# EAGLE design brain-test (EAGLE 6.4)
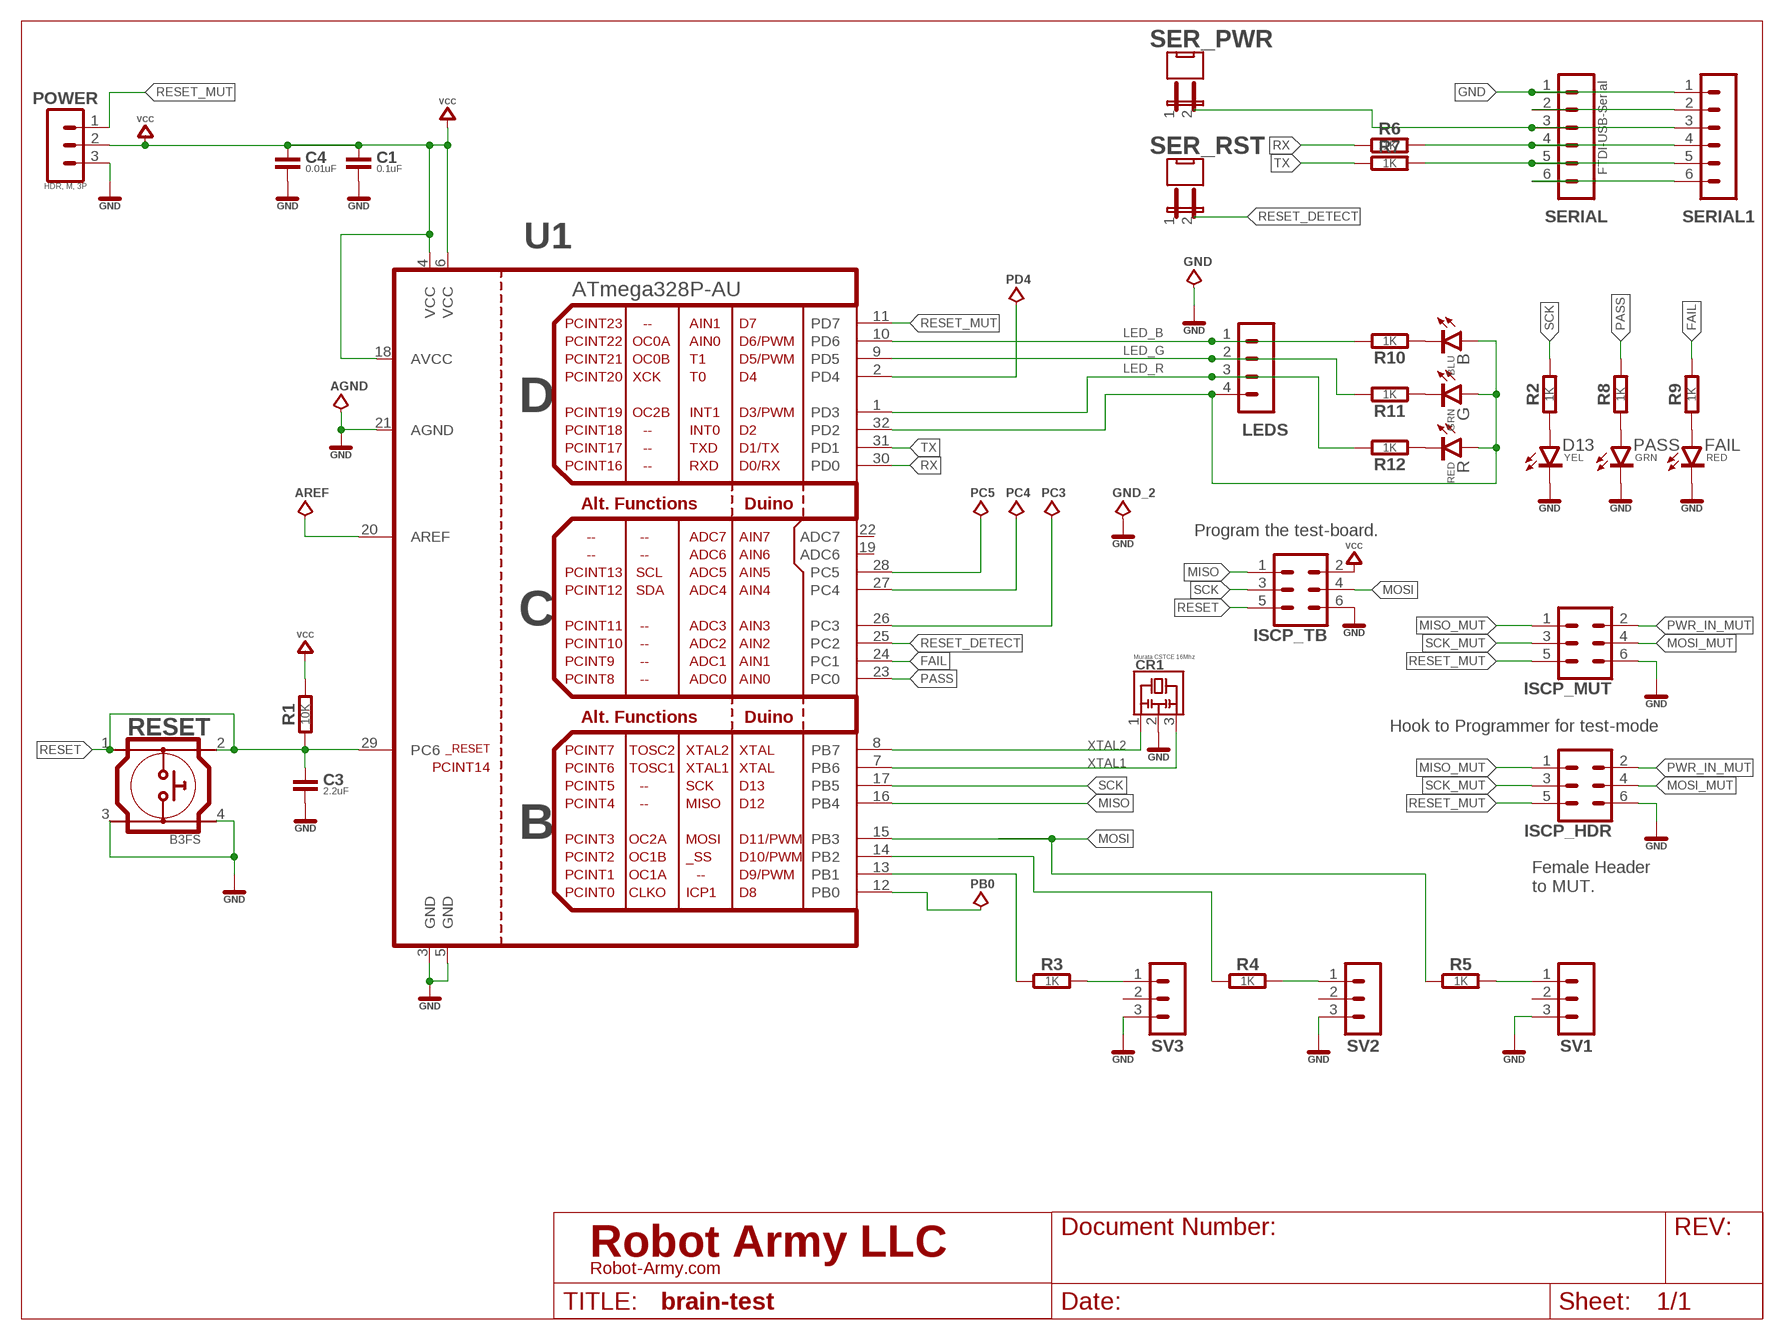
[diagram p0: schematic, sheet 1]
FRAME1 (LETTER_L-LIGHTPLAY): DOCUMENT_NUMBER: LP-BRAIN-01; REV: E

## Parts
AGND  TEST_POINT_SM_2X2  [TP-SMT-020X020]
AREF  TEST_POINT_SM_2X2  [TP-SMT-020X020]
B  BLU  SMT0603  [SMD_0603]
C1  0.1uF  CAPACITOR0603  [0603]
C3  2.2uF  CAPACITOR0603  [0603]
C4  0.01uF  CAPACITOR0603  [0603]
CR1  Murata CSTCE 16Mhz  RESONATORMURATA-CSTCE  [MURATA_CSTCE]
D13  YEL  SMT0603  [SMD_0603]
FAIL  RED  SMT0603  [SMD_0603]
G  GRN  SMT0603  [SMD_0603]
GND  TEST_POINT_SM_2X2  [TP-SMT-020X020]
GND_2  TEST_POINT_SM_2X2  [TP-SMT-020X020]
ISCP_HDR  MA03-2  [MA03-2]
ISCP_MUT  MA03-2  [MA03-2]
ISCP_TB  MA03-2  [MA03-2]
LEDS  MA04-1  [MA04-1]
PASS  GRN  SMT0603  [SMD_0603]
PB0  TEST_POINT_SM_2X2  [TP-SMT-020X020]
PC3  TEST_POINT_SM_2X2  [TP-SMT-020X020]
PC4  TEST_POINT_SM_2X2  [TP-SMT-020X020]
PC5  TEST_POINT_SM_2X2  [TP-SMT-020X020]
PD4  TEST_POINT_SM_2X2  [TP-SMT-020X020]
POWER  HDR, M, 3P  MA03-1  [MA03-1]
R  RED  SMT0603  [SMD_0603]
R1  10K  RESISTOR0603  [0603]
R2  1K  RESISTOR0603  [0603]
R3  1K  RESISTOR0603  [0603]
R4  1K  RESISTOR0603  [0603]
R5  1K  RESISTOR0603  [0603]
R6  1K  RESISTOR0603  [0603]
R7  1K  RESISTOR0603  [0603]
R8  1K  RESISTOR0603  [0603]
R9  1K  RESISTOR0603  [0603]
R10  1K  RESISTOR0603  [0603]
R11  1K  RESISTOR0603  [0603]
R12  1K  RESISTOR0603  [0603]
RESET  B3FS  PUSHBTN-SP-MOM-4PINB3FS  [B3FS]
SER_PWR  JMP01VT  [MA02-1-FAT]
SER_RST  JMP01VT  [MA02-1-FAT]
SERIAL  MA06-1  [MA06-1]
SERIAL1  MA06-1  [MA06-1]
SV1  MA03-1  [MA03-1]
SV2  MA03-1  [MA03-1]
SV3  MA03-1  [MA03-1]
U1  ATmega328P-AU  ATMEGA328  [TQFP-32-08]

## Nets
AREF: AREF.1 U1.20(AREF)
CTS: SERIAL1.2 SERIAL.2
FAIL: R9.2 U1.24(PC1)
GND [gnd]: AGND.1 C1.2 C3.2 C4.2 CR1.2 D13.K(C) FAIL.K(C) GND.1 GND_2.1 ISCP_HDR.6 ISCP_MUT.6 ISCP_TB.6 PASS.K(C) POWER.3 RESET.3 RESET.4 SERIAL1.1 SERIAL.1 SV1.3 SV2.3 SV3.3 U1.3(GND) U1.5(GND) U1.21(AGND)
LED_B: LEDS.1 R10.2 U1.10(PD6)
LED_G: LEDS.2 R11.2 U1.9(PD5)
LED_R: LEDS.3 R12.2 U1.1(PD3)
MISO: ISCP_TB.1 U1.16(PB4)
MISO_MUT: ISCP_HDR.1 ISCP_MUT.1
MOSI: ISCP_TB.4 R5.1 U1.15(PB3)
MOSI_MUT: ISCP_HDR.4 ISCP_MUT.4
N$1: D13.A R2.1
N$2: PASS.A R8.1
N$3: PD4.1 U1.2(PD4)
N$4: PC5.1 U1.28(PC5)
N$5: R3.2 SV3.1
N$6: FAIL.A R9.1
N$7: PC4.1 U1.27(PC4)
N$8: PC3.1 U1.26(PC3)
N$9: R4.2 SV2.1
N$10: R5.2 SV1.1
N$14: B.K(C) R10.1
N$15: G.K(C) R11.1
N$16: R12.1 R.K(C)
N$19: R4.1 U1.14(PB2)
N$20: R3.1 U1.13(PB1)
PASS: R8.2 U1.23(PC0)
PWR_IN: B.A G.A LEDS.4 R.A U1.32(PD2)
PWR_IN_MUT: ISCP_HDR.2 ISCP_MUT.2
RESET: C3.1 ISCP_TB.5 R1.1 RESET.1 RESET.2 U1.29(PC6)
RESET_DETECT: SER_RST.2 U1.25(PC2)
RESET_MUT: ISCP_HDR.5 ISCP_MUT.5 POWER.1 U1.11(PD7)
RTS: SERIAL1.6 SERIAL.6
RX: R6.1 U1.30(PD0)
RXD: R7.2 SERIAL1.5 SERIAL.5
SCK: ISCP_TB.3 R2.2 U1.17(PB5)
SCK_MUT: ISCP_HDR.3 ISCP_MUT.3
SERVO_EN: PB0.1 U1.12(PB0)
TX: R7.1 U1.31(PD1)
TXD: R6.2 SERIAL1.4 SERIAL.4
VCC: C1.1 C4.1 ISCP_TB.2 POWER.2 R1.2 U1.4(VCC) U1.6(VCC) U1.18(AVCC)
VCC5: SER_PWR.2 SERIAL1.3 SERIAL.3
XTAL1: CR1.3 U1.7(PB6)
XTAL2: CR1.1 U1.8(PB7)
Unconnected: SER_PWR.1 SER_RST.1 SV1.2 SV2.2 SV3.2 U1.19(ADC6) U1.22(ADC7)

## Notes on the sheet
- FTDI-USB-Serial
- Program the test-board.
- Hook to Programmer for test-mode
- Female Header
  to MUT.

## Library data of the parts
AGND AREF GND GND_2 PB0 PC3-PC5 PD4 = test-points:TEST_POINT: Test point
B D13 FAIL G PASS R = led:SMT: LED SMT 0603 0805 1206
C1 C3 C4 = rlc:CAPACITOR: Capacitor
CR1 = ceramic-resonators:RESONATOR
ISCP_HDR ISCP_MUT ISCP_TB = con-headers:MA03-2: PIN HEADER
LEDS = con-headers:MA04-1: PIN HEADER
POWER SV1-SV3 = con-headers:MA03-1: PIN HEADER
R1-R12 = rlc:RESISTOR: Resistor
RESET = switch-smd:PUSHBTN-SP-MOM-4PIN: Omron B3S Series Push Button Switch
SER_PWR SER_RST = con-headers:JMP01: Jumper, 1 position (2 pins)
SERIAL SERIAL1 = con-headers:MA06-1: PIN HEADER
U1 = atmel-atmega:ATMEGA328

## Net classes
0 default: width 0.152 mm, clearance 0.152 mm
1 power: width 0.406 mm, drill 0.33 mm, clearance 0.152 mm
2 gnd: width 0.203 mm, drill 0.33 mm, clearance 0.152 mm
3 usbvcc: width 0.203 mm, drill 0.33 mm, clearance 0.152 mm
4 aref: width 0.203 mm, drill 0.33 mm, clearance 0.152 mm

## Board
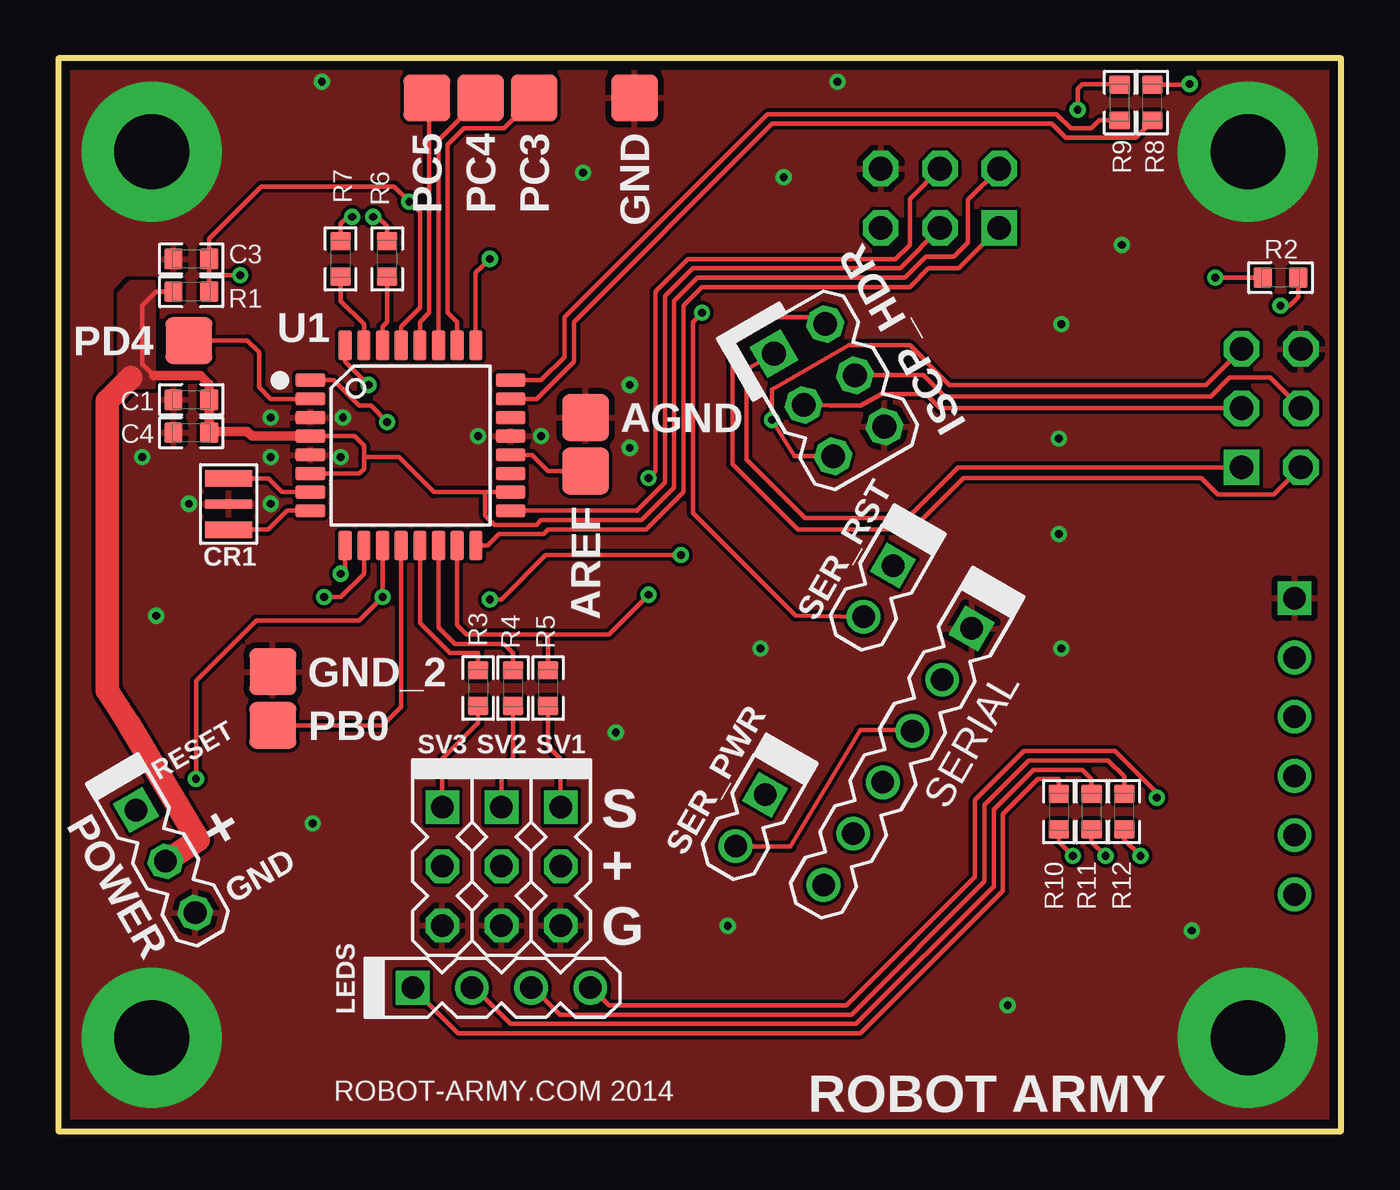
[diagram p1: board, top side]
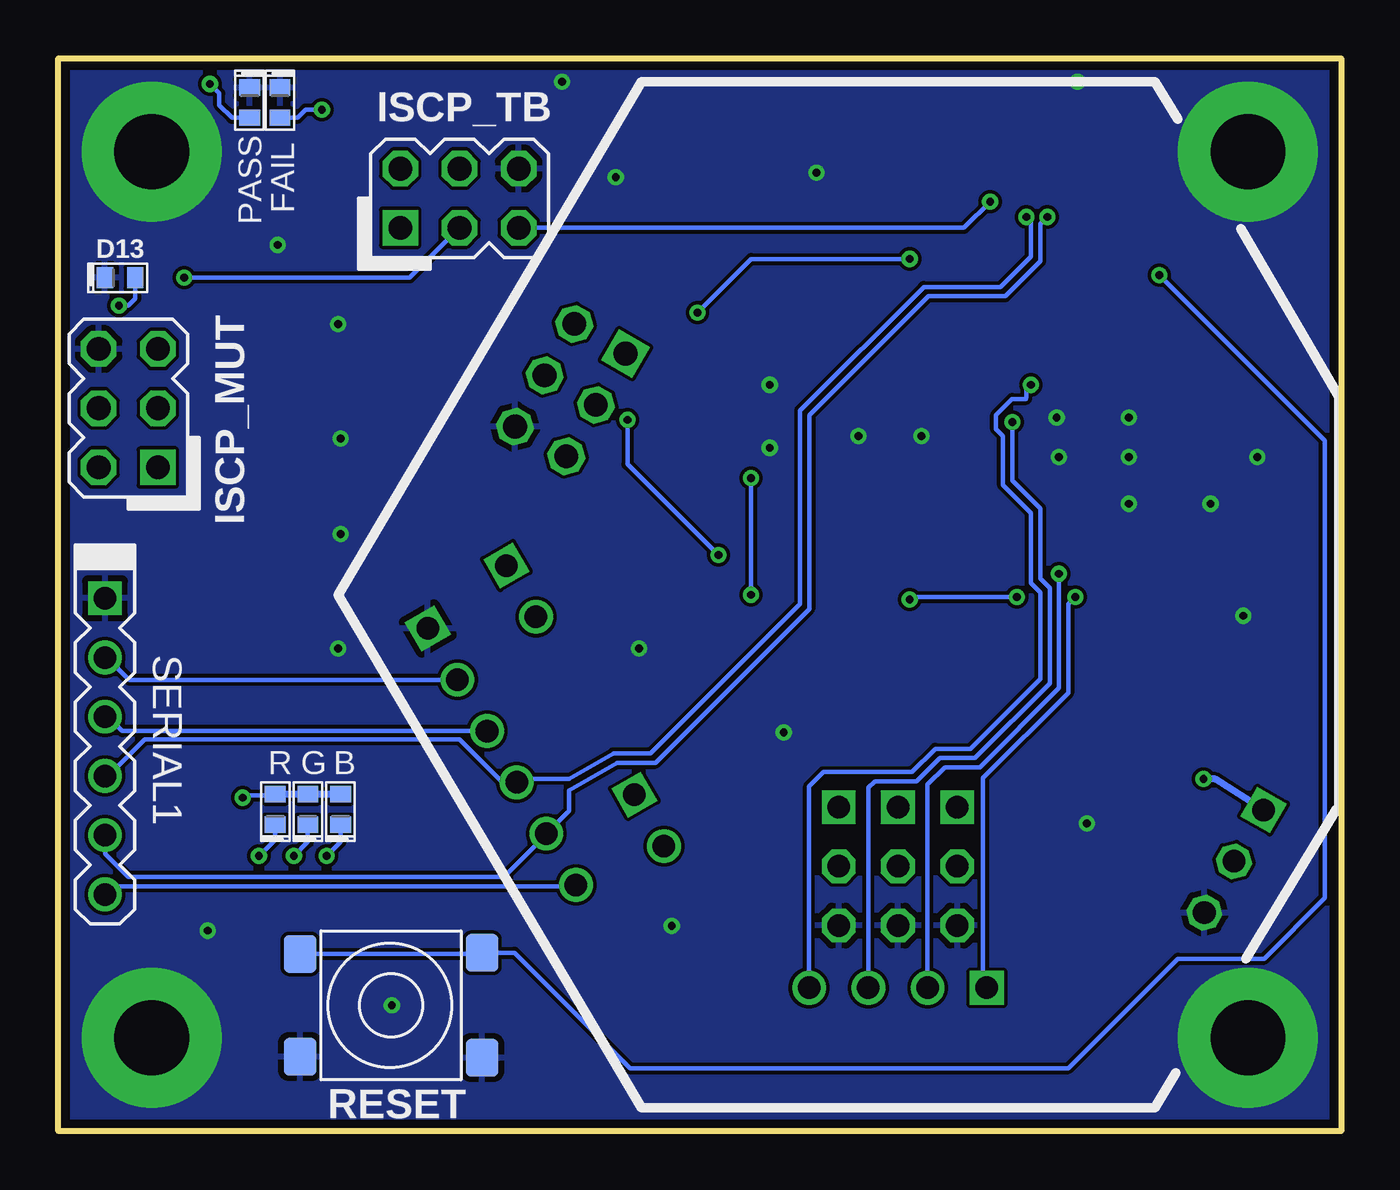
[diagram p2: board, bottom side, seen from below]

Size 55 x 46 mm. Coordinates in mm from the lower left corner, seen from the top.
Outline: 0,0 55,0 55,46 0,46 0,0
Copper layers (1*16): Top 0.0356mm / dielectric 1.5011mm / Bottom 0.0356mm
Design rules "OSH-CircuitMonkey": minimum track width 6mil, minimum drill 13mil, track to track 6mil, track to pad 6mil, pad to pad 6mil, via to via 6mil, smd to smd 6mil, copper to edge 15mil, drill to drill 6mil, minimum pad ring 7mil, minimum via ring 7mil, stop-mask expansion 3mil, vias tented up to drill 13mil, thermal gap 10mil

### Footprints (pad centres in the part's own frame; a part is rotated, then mirrored left to right if it is on the bottom)
TP-SMT-020X020 = smd 2 x 2: 1 0,0
SMD_0603 = smd 0.7 x 0.9: A 0.65,0; K -0.65,0
0603 = smd 0.8 x 0.9: 1 -0.763,0; 2 0.763,0
MURATA_CSTCE = smd 0.7 x 2: 1 -1.1,0; 3 1.1,0 | smd 0.4 x 2: 2 0,0
MA03-2 = drill 1.016 square: 1 -2.54,-1.27 | drill 1.016 octagon: 2 -2.54,1.27; 3 0,-1.27; 4 0,1.27; 5 2.54,-1.27; 6 2.54,1.27
MA04-1 = drill 0.965 square: 1 -3.81,0 | drill 0.965: 2 -1.27,0; 3 1.27,0; 4 3.81,0
MA03-1 = drill 0.965 square: 1 -2.54,0 | drill 0.965 octagon: 2 0,0; 3 2.54,0
B3FS = smd 1.4 x 1.6: 1 3.9,-2.2; 2 -3.9,-2.25; 3 3.9,2.2; 4 -3.9,2.25
MA02-1-FAT = drill 0.965 square: 1 -1.27,0 | drill 0.965: 2 1.27,0
MA06-1 = drill 0.965 square: 1 -6.35,0 | drill 0.965: 2 -3.81,0; 3 -1.27,0; 4 1.27,0; 5 3.81,0; 6 6.35,0
TQFP-32-08 = smd 1.27 x 0.559: 1 -4.293,2.8; 2 -4.293,2; 3 -4.293,1.2; 4 -4.293,0.4; 5 -4.293,-0.4; 6 -4.293,-1.2; 7 -4.293,-2; 8 -4.293,-2.8; 17 4.293,-2.8; 18 4.293,-2; 19 4.293,-1.2; 20 4.293,-0.4; 21 4.293,0.4; 22 4.293,1.2; 23 4.293,2; 24 4.293,2.8 | smd 0.559 x 1.27: 9 -2.8,-4.293; 10 -2,-4.293; 11 -1.2,-4.293; 12 -0.4,-4.293; 13 0.4,-4.293; 14 1.2,-4.293; 15 2,-4.293; 16 2.8,-4.293; 25 2.8,4.293; 26 2,4.293; 27 1.2,4.293; 28 0.4,4.293; 29 -0.4,4.293; 30 -1.2,4.293; 31 -2,4.293; 32 -2.8,4.293

### Placement (x,y rotation side)
AGND  22.6,30.6 0 top
AREF  22.6,28.3 270 top
B  42.9,13.8 90 bottom
C1  5.7,31.36 180 top
C3  5.7,37.4 180 top
C4  5.7,29.95 180 top
CR1  7.3,26.89 90 top
D13  52.35,36.6 0 bottom
FAIL  45.5,44.1 270 bottom
G  44.3,13.8 90 bottom
GND  24.7,44.3 270 top
GND_2  9.2,19.7 0 top
ISCP_HDR  33.05,31.77 300 top
ISCP_MUT  52,31 90 bottom
ISCP_TB  37.8,40 0 bottom
LEDS  19,6.15 0 top
PASS  46.8,44.1 270 bottom
PB0  9.2,17.4 0 top
PC3  20.4,44.3 270 top
PC4  18.1,44.3 270 top
PC5  15.8,44.3 270 top
PD4  5.6,33.9 180 top
POWER  4.6,11.57 300 top
R  45.7,13.8 90 bottom
R1  5.7,36 180 top
R2  52.4,36.6 180 top
R3  18,19 270 top
R4  19.5,19 270 top
R5  21,19 270 top
R6  14.1,37.4 90 top
R7  12.1,37.4 90 top
R8  46.9,44.1 270 top
R9  45.5,44.1 270 top
R10  42.9,13.7 90 top
R11  44.3,13.7 90 top
R12  45.7,13.7 90 top
RESET  40.73,5.4 180 bottom
SER_PWR  29.67,13.32 240 top
SER_RST  35.15,23.15 240 top
SERIAL  35.98,16.06 240 top
SERIAL1  53,16.5 270 bottom
SV1  21.54,11.36 270 top
SV2  19,11.36 270 top
SV3  16.46,11.36 270 top
U1  15.1,29.4 0 top

### Tracks (layer width: path | path; a pad name or v marks a point on that pad's centre or on a via)
AREF
  Top 0.203: U1.20 20.3,29 21,28.3 AREF.1
CTS
  Bottom 0.203: SERIAL1.2 52.91,20.31 51.96,19.36 SERIAL.2
FAIL
  Top 0.203: R9.2 44.64,43.34 44.3,43 43.4,43 42.8,43.6 30.4,43.6 21.7,34.9 21.7,33.2 20.7,32.2 U1.24
GND  (via drill 0.33, 3.2 pad 6)
  other vias: 4,4 51,4 4,42 51,42 12.1,28.9 9.1,28.9 5.6,26.9 9.1,26.9 3.6,28.9 9.1,30.6 12.2,30.6 18,29.8 20.7,29.8 24.5,29.3 24.5,32 22.5,41.1 33.4,45 11.3,45 43,34.6 42.9,29.7 42.9,25.6 45.6,38 10.9,13.2 4.2,22.1 23.9,17.1 30.1,20.7 28.7,8.8 40.7,5.4 48.6,8.6 43,20.7 31.1,40.9
  pour Bottom: 0,0 55,0 55,46 0,46
  pour Top (rank 6): 0,0 55,0 55,46 0,46
LED_B  (via drill 0.33)
  Top 0.203: U1.10 13.1,23.9 12.1,22.9 v11.4,22.9 | R10.2 42.9,15.1 42,15.1 40.5,13.6 40.5,10.3 34.4,4.2 17.14,4.2 LEDS.1
  Bottom 0.203: v11.4,22.9 11.7,22.6 11.7,18.8 15.35,15.15 15.35,6.31 LEDS.1
LED_G  (via drill 0.33)
  Top 0.203: LEDS.2 17.85,6.15 19.4,4.6 34.2,4.6 40.1,10.5 40.1,13.8 41.8,15.5 43.9,15.5 44.3,15.1 R11.2 | U1.9 12.3,24.1 v12.1,23.9
  Bottom 0.203: LEDS.2 17.73,14.87 17,15.6 15.5,15.6 12.1,19 v12.1,23.9
LED_R  (via drill 0.33)
  Top 0.203: LEDS.3 20.35,6.15 21.5,5 34,5 39.7,10.7 39.7,14 41.6,15.9 45,15.9 45.7,15.2 R12.2 | U1.1 11.8,32.2 12.9,31.1 13.4,31.1 v14.1,30.4
  Bottom 0.203: LEDS.3 20.27,14.73 20,15 18.2,15 17.2,16 15.7,16 12.5,19.2 12.5,23.3 12.9,23.7 12.9,26.7 14.1,27.9 v14.1,30.4
MISO
  Top 0.203: ISCP_TB.1 38.61,37 37.3,37 36.5,36.2 27.6,36.2 26.8,35.4 26.8,27.4 25.2,25.8 21,25.8 20.8,25.6 18.9,25.6 18.41,25.11 U1.16
MISO_MUT
  Top 0.203: ISCP_MUT.1 38.56,28.46 36.4,26.3 32,26.3 29.5,28.8 29.5,32.66 ISCP_HDR.1
MOSI  (via drill 0.33)
  Top 0.203: 21,21.3 17.5,21.3 17.1,21.7 U1.15 | ISCP_TB.4 36.5,39.97 36.5,38 35.9,37.4 27,37.4 25.6,36 25.6,28.3 v25.3,28 | 21,21.3 R5.1 | 21,21.3 23.6,21.3 v25.3,23
  Bottom 0.203: v25.3,28 v25.3,23
MOSI_MUT
  Top 0.203: ISCP_MUT.4 51.97,32.3 50.2,32.3 49.4,31.5 38,31.5 37.09,32.41 ISCP_HDR.4
N$1  (via drill 0.33)
  Top 0.203: R2.1 53.16,35.76 52.8,35.4 v52.4,35.4
  Bottom 0.203: v52.4,35.4 52,35.4 51.7,35.7 51.7,36 D13.A
N$2  (via drill 0.33)
  Top 0.203: 46.94,44.9 R8.1 48.46,44.86 v48.5,44.9
  Bottom 0.203: PASS.A 47.55,43.45 48.1,44 48.1,44.5 v48.5,44.9
N$3
  Top 0.203: U1.2 9.1,31.4 8.6,31.9 8.6,33.4 8.1,33.9 PD4.1
N$4
  Top 0.203: U1.28 15.5,34.7 15.9,35.1 15.9,44.2 PC5.1
N$5
  Top 0.203: R3.2 18,17.5 16.46,15.96 SV3.1
N$6  (via drill 0.33)
  Top 0.203: v43.7,43.8 43.7,44.7 43.9,44.9 45.46,44.9 R9.1
  Bottom 0.203: FAIL.A 44.75,43.45 44.4,43.8 v43.7,43.8
N$7
  Top 0.203: U1.27 16.3,42.5 PC4.1
N$8
  Top 0.203: U1.26 17.1,34.7 16.7,35.1 16.7,42.3 17.4,43 19.1,43 PC3.1
N$9
  Top 0.203: R4.2 19.5,16 19,15.5 SV2.1
N$10
  Top 0.203: R5.2 21,16.5 21.54,15.96 SV1.1
N$14  (via drill 0.33)
  Top 0.203: R10.1 42.9,12.4 v43.5,11.8
  Bottom 0.203: v43.5,11.8 42.9,12.4 B.K
N$15  (via drill 0.33)
  Top 0.203: R11.1 44.3,12.4 v44.9,11.8
  Bottom 0.203: v44.9,11.8 44.3,12.4 G.K
N$16  (via drill 0.33)
  Top 0.203: v46.4,11.8 45.7,12.5 R12.1
  Bottom 0.203: R.K 45.7,12.5 v46.4,11.8
N$19
  Top 0.203: U1.14 16.3,23.6 16.3,21.6 17,20.9 19.1,20.9 19.4,20.6 19.5,20.5 R4.1
N$20
  Top 0.203: U1.13 15.5,23 15.5,21.8 16.8,20.5 18,20.5 R3.1
PASS
  Top 0.203: 46.9,43.3 46.2,42.6 43.2,42.6 42.6,43.2 30.6,43.2 30,42.6 22.1,34.7 22.1,33 20.5,31.4 U1.23
  Top 0.305: R8.2 46.9,43.3
PWR_IN  (via drill 0.33)
  Top 0.203: LEDS.4 22.85,6.15 23.6,5.4 33.8,5.4 39.3,10.9 39.3,14.2 41.4,16.3 45.3,16.3 47.1,14.5 v47.1,14.3 | U1.32 12.3,33 v13.3,32
  Bottom 0.203: LEDS.4 22.81,14.79 22.2,15.4 18.4,15.4 17.4,16.4 15.9,16.4 12.9,19.4 12.9,23.1 13.3,23.5 13.3,26.5 14.5,27.7 14.5,29.8 14.8,30.1 14.8,30.7 14.11,31.39 13.51,31.39 13.5,31.5 13.5,32 v13.3,32 | v47.1,14.3 47,14.4 45.75,14.4 R.A
  Bottom 0.305: R.A G.A B.A
PWR_IN_MUT
  Top 0.203: ISCP_MUT.2 52.1,27.3 49.7,27.3 49,28 38.8,28 36.6,25.8 31.7,25.8 28.9,28.6 28.9,32.8 28.8,33.7 30.8,34.9 32.59,34.9 ISCP_HDR.2
  Top 0.305: ISCP_MUT.2
RESET  (via drill 0.33)
  Top 0.203: 6.46,36.7 C3.1 6.46,38.26 8.7,40.5 14.4,40.5 v15.05,39.85 15.5,39.4 15.5,35.3 14.7,34.5 U1.29 | 6.46,36.7 R1.1 | v7.8,36.7 6.46,36.7
  Bottom 0.203: RESET.1 36.88,7.6 RESET.2 35.45,7.65 30.5,2.7 11.7,2.7 7,7.4 3.3,7.4 0.7,10 0.7,29.6 v7.8,36.7 | ISCP_TB.5 16.17,38.73 v15.05,39.85
RESET_DETECT  (via drill 0.33)
  Top 0.203: SER_RST.2 31.6,22.1 27.2,26.5 27.2,34.7 v27.6,35.1 | U1.25 17.9,36.8 v18.5,37.4
  Bottom 0.203: v27.6,35.1 25.3,37.4 v18.5,37.4
RESET_MUT  (via drill 0.33)
  Top 0.203: v5.9,15.1 5.9,19.3 8.5,21.9 12.9,21.9 v13.9,22.9 U1.11 | ISCP_MUT.5 49.19,32 38.2,32 36.5,33.7 33.9,33.7 30.6,31.8 v30.6,30.5 31.56,28.94 ISCP_HDR.5 | v26.7,24.7 20.9,24.7 19,22.8 v18.5,22.8
  Bottom 0.203: v30.6,30.5 30.6,28.6 v26.7,24.7 | v18.5,22.8 18.4,22.9 v13.9,22.9 13.85,22.85
  Bottom 0.305: POWER.1 5.4,15.1 v5.9,15.1
RTS
  Bottom 0.203: SERIAL.6 33.14,10.56 33.2,10.5 52.4,10.5 52.79,10.16 SERIAL1.6
RX
  Top 0.203: U1.30 13.9,34.5 14.1,34.7 R6.1
RXD  (via drill 0.33)
  Top 0.203: v12.6,39.2 12.4,39.2 12.1,38.9 R7.2
  Bottom 0.203: v12.6,39.2 12.9,38.9 12.9,37.3 14.4,35.8 17.7,35.8 22.8,30.7 22.8,22.4 29.4,15.8 31.04,15.8 33.1,14.6 33.1,13.74 SERIAL.5 34.08,12.72 35.9,10.9 52,10.9 53,11.9 SERIAL1.5
SCK  (via drill 0.33)
  Top 0.203: ISCP_TB.3 37,37.93 37,37.9 36.1,37 27.2,37 26,35.8 26,27.8 24.8,26.6 U1.17 | v49.6,36.6 R2.2
  Bottom 0.203: ISCP_TB.3 39.93,36.6 v49.6,36.6
SCK_MUT
  Top 0.203: ISCP_MUT.3 37.8,31 37.2,31.6 35.3,31.6 34.4,31.1 33.1,31.1 ISCP_HDR.3
SERVO_EN
  Top 0.203: PB0.1 13.9,17.4 14.7,18.2 U1.12
TX
  Top 0.203: U1.31 13.1,34.6 12.1,35.6 R7.1
TXD  (via drill 0.33)
  Top 0.203: v13.5,39.2 13.7,39.2 14.1,38.8 R6.2
  Bottom 0.203: SERIAL1.4 52.93,15.23 52.76,15.36 52.5,15.6 51.3,16.8 37.8,16.8 35.96,14.96 SERIAL.4 35.21,15.1 33.1,15.1 31.2,16.2 29.61,16.2 29.6,16.21 | v13.5,39.2 13.3,39 13.3,37.5 14.6,36.2 17.9,36.2 23.2,30.9 23.2,22.61 29.6,16.21 | 29.6,16.21 29.6,16.2
VCC
  Top 0.203: 6.51,30 C4.1 | U1.4 12.7,29.8 13.1,29.4 13.1,28.9 | 13.1,28.9 13.1,28.4 12.9,28.2 U1.6 | U1.18 18.3,27.4 | 18.3,27.4 16.1,27.4 14.6,28.9 13.1,28.9 | 4.1,32.4 3.6,32.9 3.6,35.4 4.2,36 R1.2 | ISCP_TB.2 39,39.93 39,38.1 38.4,37.5 37.2,37.5 36.3,36.6 27.4,36.6 26.4,35.6 26.4,27.6 25,26.2 20.7,26.2 20.5,26 18.7,26 18.3,26.4 18.3,27.4
  Top 0.406: U1.4 8.3,29.8 8.1,30 6.51,30 | C4.1 C1.1 6.46,32.04 6.1,32.4 4.1,32.4
  Top 1.016: POWER.2 6,12.5 3,17.5 2.1,18.9 2.1,31.3 3.1,32.3
  pour Top (rank 4): 4.1,36.4 3.1,36.4 2.6,35.9 2.6,31.9 4.1,31.9
VCC5
  Top 0.203: SER_PWR.2 29.68,12.22 29.7,12.2 31.4,12.2 34.4,17.2 36.58,17.2 SERIAL.3
  Bottom 0.203: SERIAL.3 52.26,17.16 52.87,17.77 SERIAL1.3
XTAL1
  Top 0.203: U1.7 9.6,27.4 9.01,27.99 CR1.3
XTAL2
  Top 0.203: U1.8 9.8,26.6 8.99,25.79 CR1.1

### Text on the board
tPlace: RESET | S | + | GND | + | G | ROBOT ARMY | ROBOT-ARMY.COM 2014